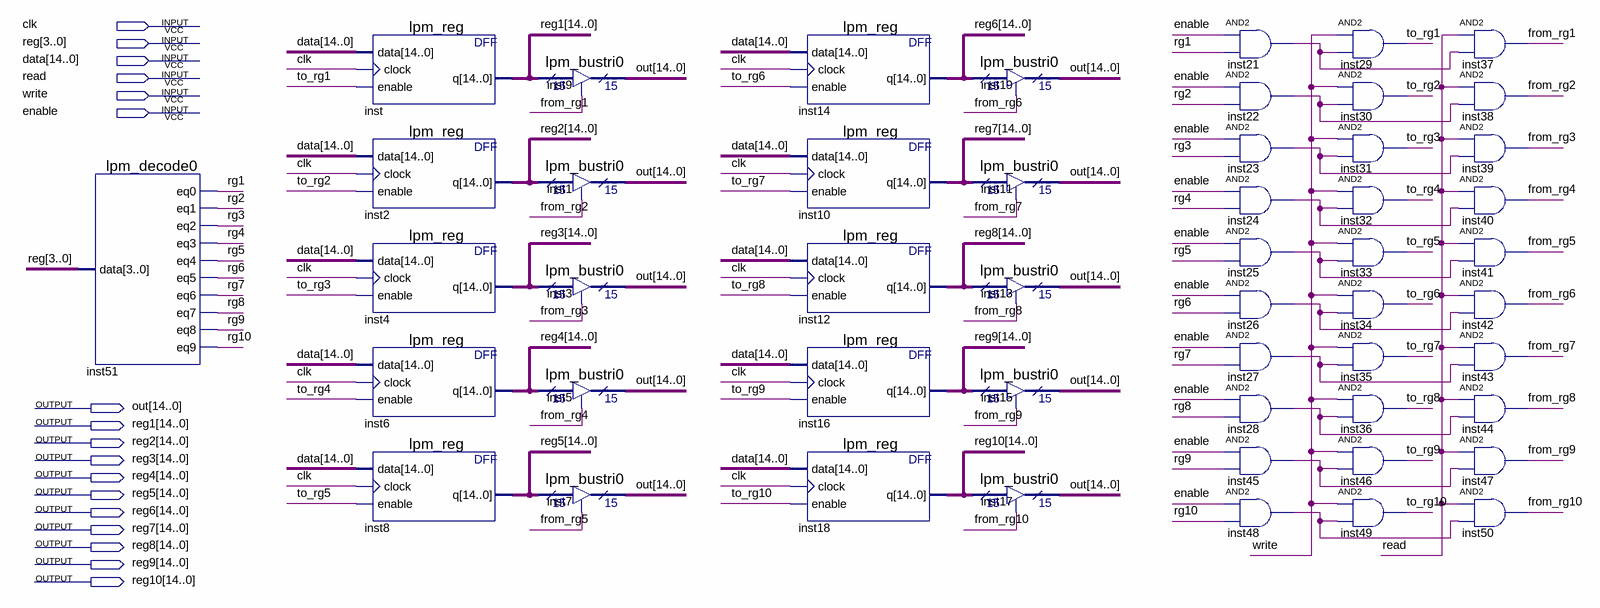
[diagram p0: schematic sheet]
// Quartus schematic registers.bdf as structural Verilog: 51 symbols, 17 pins
module registers (
  input  clk,
  input  [3:0] \reg ,
  input  [14:0] data,
  input  read,
  input  write,
  input  enable,
  output [14:0] out,
  output [14:0] reg1,
  output [14:0] reg2,
  output [14:0] reg3,
  output [14:0] reg4,
  output [14:0] reg5,
  output [14:0] reg6,
  output [14:0] reg7,
  output [14:0] reg8,
  output [14:0] reg9,
  output [14:0] reg10
);

  wire from_rg1, from_rg2, from_rg3, from_rg4, from_rg5, from_rg6, from_rg7, from_rg8, from_rg9, from_rg10,
       inst21_out, inst22_out, inst23_out, inst24_out, inst25_out, inst26_out, inst27_out, inst28_out,
       inst45_out, inst48_out, rg1, rg2, rg3, rg4, rg5, rg6, rg7, rg8, rg9, rg10, to_rg1, to_rg2, to_rg3,
       to_rg4, to_rg5, to_rg6, to_rg7, to_rg8, to_rg9, to_rg10;

  lpm_decode0 inst51 (
    .data(\reg ), .eq0(rg1), .eq1(rg2), .eq2(rg3), .eq3(rg4), .eq4(rg5), .eq5(rg6), .eq6(rg7), .eq7(rg8),
    .eq8(rg9), .eq9(rg10));
  lpm_reg inst (.data(data), .clock(clk), .enable(to_rg1), .q(reg1));
  lpm_reg inst2 (.data(data), .clock(clk), .enable(to_rg2), .q(reg2));
  lpm_reg inst4 (.data(data), .clock(clk), .enable(to_rg3), .q(reg3));
  lpm_reg inst6 (.data(data), .clock(clk), .enable(to_rg4), .q(reg4));
  lpm_reg inst8 (.data(data), .clock(clk), .enable(to_rg5), .q(reg5));
  lpm_bustri0 inst9 (.enabledt(from_rg1), .data(reg1), .tridata(out));
  lpm_bustri0 inst1 (.enabledt(from_rg2), .data(reg2), .tridata(out));
  lpm_bustri0 inst3 (.enabledt(from_rg3), .data(reg3), .tridata(out));
  lpm_bustri0 inst5 (.enabledt(from_rg4), .data(reg4), .tridata(out));
  lpm_bustri0 inst7 (.enabledt(from_rg5), .data(reg5), .tridata(out));
  lpm_reg inst14 (.data(data), .clock(clk), .enable(to_rg6), .q(reg6));
  lpm_reg inst10 (.data(data), .clock(clk), .enable(to_rg7), .q(reg7));
  lpm_reg inst12 (.data(data), .clock(clk), .enable(to_rg8), .q(reg8));
  lpm_reg inst16 (.data(data), .clock(clk), .enable(to_rg9), .q(reg9));
  lpm_reg inst18 (.data(data), .clock(clk), .enable(to_rg10), .q(reg10));
  lpm_bustri0 inst19 (.enabledt(from_rg6), .data(reg6), .tridata(out));
  lpm_bustri0 inst11 (.enabledt(from_rg7), .data(reg7), .tridata(out));
  lpm_bustri0 inst13 (.enabledt(from_rg8), .data(reg8), .tridata(out));
  lpm_bustri0 inst15 (.enabledt(from_rg9), .data(reg9), .tridata(out));
  lpm_bustri0 inst17 (.enabledt(from_rg10), .data(reg10), .tridata(out));
  and inst21 (inst21_out, enable, rg1);
  and inst22 (inst22_out, enable, rg2);
  and inst23 (inst23_out, enable, rg3);
  and inst24 (inst24_out, enable, rg4);
  and inst25 (inst25_out, enable, rg5);
  and inst26 (inst26_out, enable, rg6);
  and inst27 (inst27_out, enable, rg7);
  and inst28 (inst28_out, enable, rg8);
  and inst45 (inst45_out, enable, rg9);
  and inst48 (inst48_out, enable, rg10);
  and inst29 (to_rg1, write, inst21_out);
  and inst30 (to_rg2, write, inst22_out);
  and inst31 (to_rg3, write, inst23_out);
  and inst32 (to_rg4, write, inst24_out);
  and inst33 (to_rg5, write, inst25_out);
  and inst34 (to_rg6, write, inst26_out);
  and inst35 (to_rg7, write, inst27_out);
  and inst36 (to_rg8, write, inst28_out);
  and inst46 (to_rg9, write, inst45_out);
  and inst49 (to_rg10, write, inst48_out);
  and inst37 (from_rg1, read, inst21_out);
  and inst38 (from_rg2, read, inst22_out);
  and inst39 (from_rg3, read, inst23_out);
  and inst40 (from_rg4, read, inst24_out);
  and inst41 (from_rg5, read, inst25_out);
  and inst42 (from_rg6, read, inst26_out);
  and inst43 (from_rg7, read, inst27_out);
  and inst44 (from_rg8, read, inst28_out);
  and inst47 (from_rg9, read, inst45_out);
  and inst50 (from_rg10, read, inst48_out);
endmodule
